# EAGLE design Relay_Board (EAGLE 7.1.0)
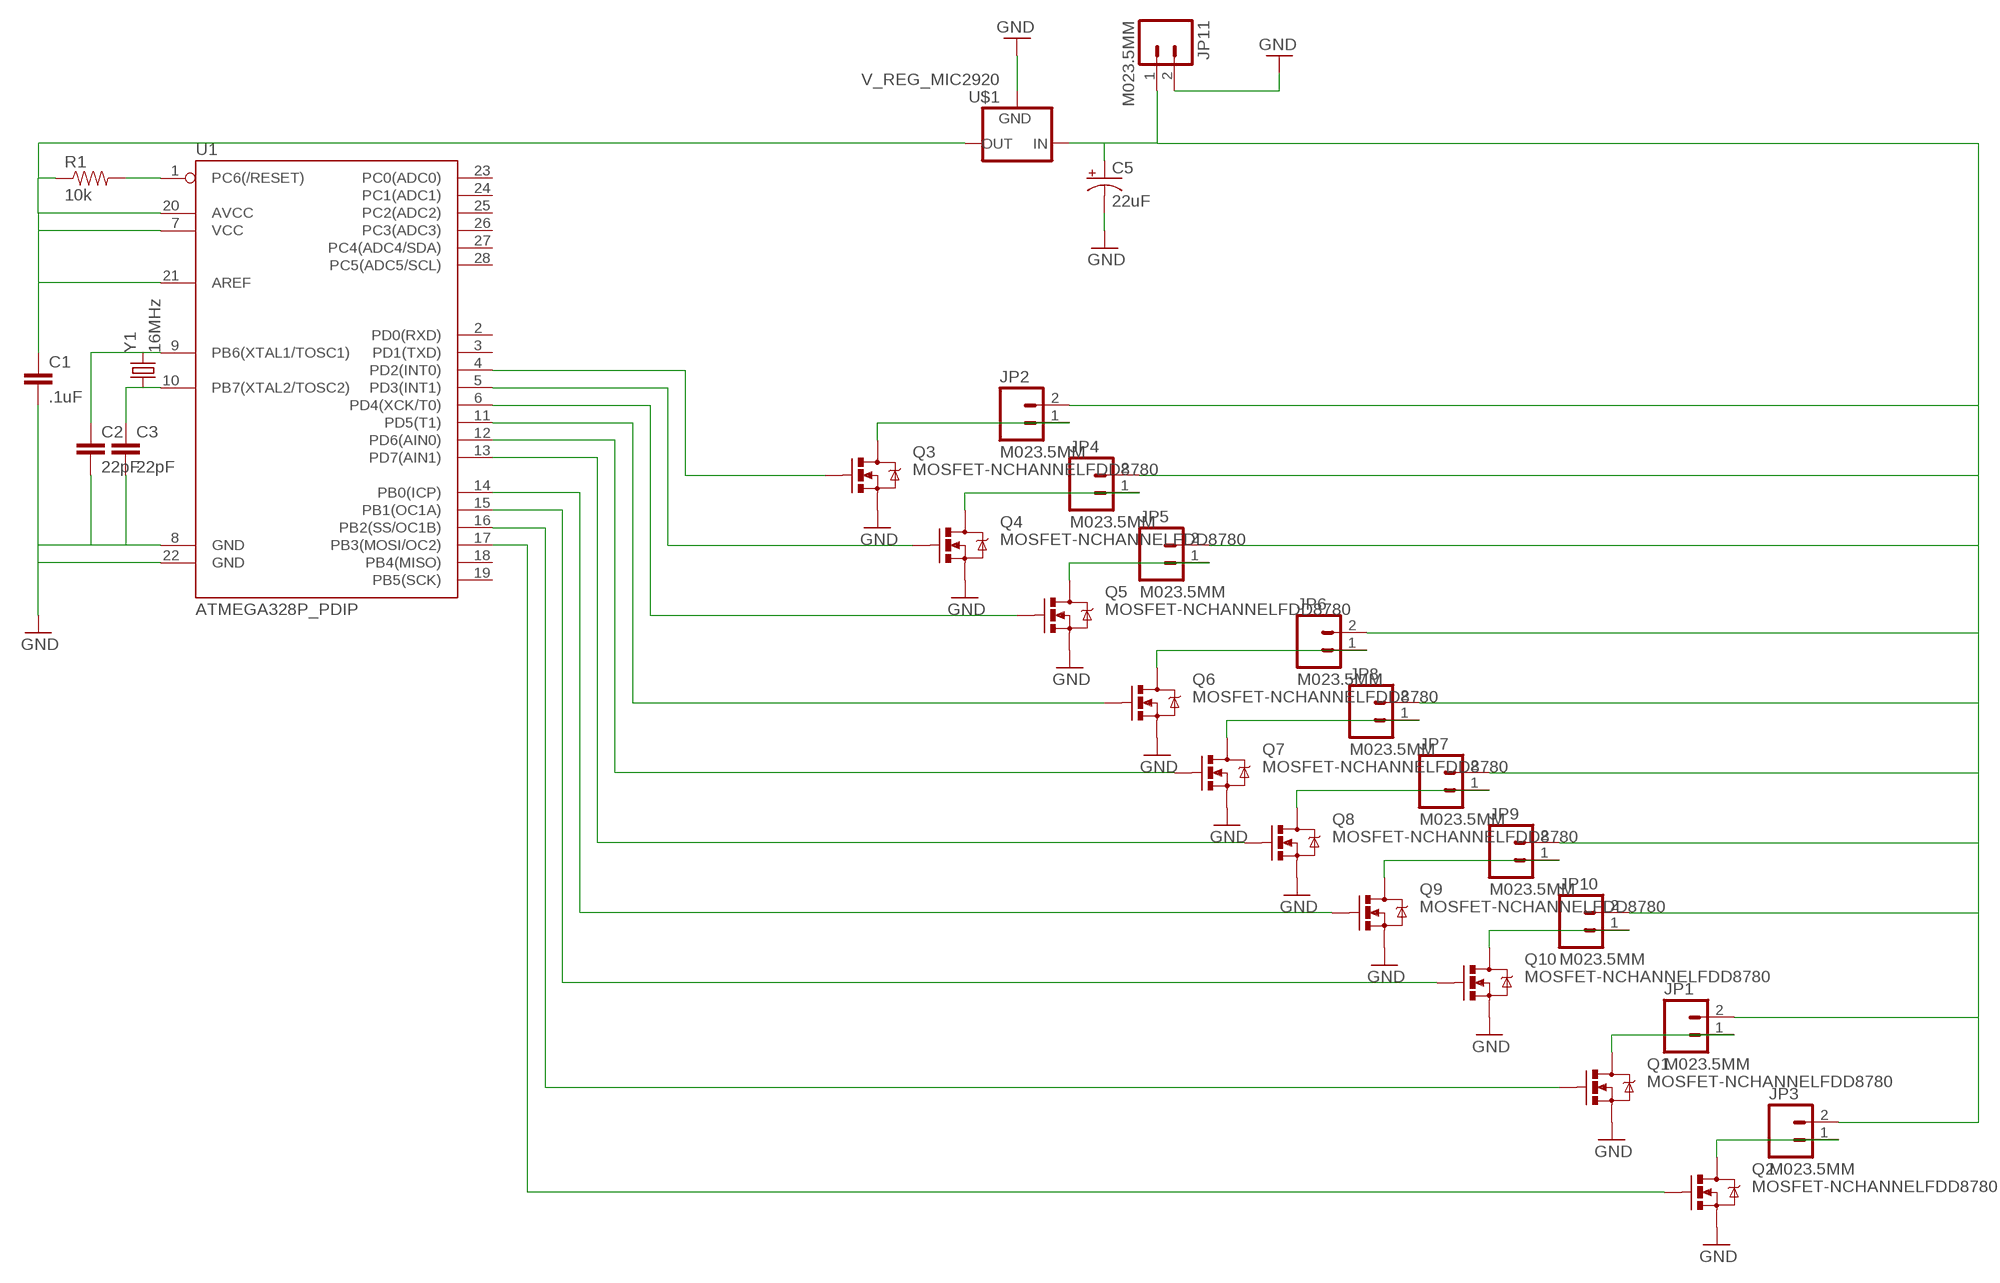
[diagram p0: schematic, sheet 1]

## Parts
C1  .1uF  CAP1206  [1206]
C2  22pF  CAP1206  [1206]
C3  22pF  CAP1206  [1206]
C5  22uF  CAP_POLC  [PANASONIC_C]
JP1  M023.5MM  [SCREWTERMINAL-3.5MM-2]
JP2  M023.5MM  [SCREWTERMINAL-3.5MM-2]
JP3  M023.5MM  [SCREWTERMINAL-3.5MM-2]
JP4  M023.5MM  [SCREWTERMINAL-3.5MM-2]
JP5  M023.5MM  [SCREWTERMINAL-3.5MM-2]
JP6  M023.5MM  [SCREWTERMINAL-3.5MM-2]
JP7  M023.5MM  [SCREWTERMINAL-3.5MM-2]
JP8  M023.5MM  [SCREWTERMINAL-3.5MM-2]
JP9  M023.5MM  [SCREWTERMINAL-3.5MM-2]
JP10  M023.5MM  [SCREWTERMINAL-3.5MM-2]
JP11  M023.5MM  [SCREWTERMINAL-3.5MM-2]
Q1  MOSFET-NCHANNELFDD8780  [DPAK]
Q2  MOSFET-NCHANNELFDD8780  [DPAK]
Q3  MOSFET-NCHANNELFDD8780  [DPAK]
Q4  MOSFET-NCHANNELFDD8780  [DPAK]
Q5  MOSFET-NCHANNELFDD8780  [DPAK]
Q6  MOSFET-NCHANNELFDD8780  [DPAK]
Q7  MOSFET-NCHANNELFDD8780  [DPAK]
Q8  MOSFET-NCHANNELFDD8780  [DPAK]
Q9  MOSFET-NCHANNELFDD8780  [DPAK]
Q10  MOSFET-NCHANNELFDD8780  [DPAK]
R1  10k  RESISTOR1206  [1206]
U1  ATMEGA328P_PDIP  [DIL28-3]
U$1  V_REG_MIC2920  [SOT223]
Y1  16MHz  CRYSTAL5X3  [CRYSTAL-SMD-5X3]

## Nets
12V: C5.+ JP1.2 JP2.2 JP3.2 JP4.2 JP5.2 JP6.2 JP7.2 JP8.2 JP9.2 JP10.2 JP11.1 U$1.1(IN)
GND: C1.2 C2.2 C3.2 C5.- JP11.2 Q1.3(S) Q2.3(S) Q3.3(S) Q4.3(S) Q5.3(S) Q6.3(S) Q7.3(S) Q8.3(S) Q9.3(S) Q10.3(S) U1.8(GND) U1.22(GND) U$1.2(GND)
N$1: Q1.1(G) U1.16(PB2(SS/OC1B))
N$2: R1.2 U1.1(PC6(/RESET))
N$3: C2.1 U1.9(PB6(XTAL1/TOSC1)) Y1.3
N$4: C3.1 U1.10(PB7(XTAL2/TOSC2)) Y1.1
N$5: Q2.1(G) U1.17(PB3(MOSI/OC2))
N$6: JP1.1 Q1.4(D)
N$7: JP3.1 Q2.4(D)
N$8: JP2.1 Q3.4(D)
N$9: Q3.1(G) U1.4(PD2(INT0))
N$10: Q4.1(G) U1.5(PD3(INT1))
N$11: JP4.1 Q4.4(D)
N$12: JP5.1 Q5.4(D)
N$13: Q5.1(G) U1.6(PD4(XCK/T0))
N$14: JP6.1 Q6.4(D)
N$15: Q7.1(G) U1.12(PD6(AIN0))
N$16: JP8.1 Q7.4(D)
N$17: JP7.1 Q8.4(D)
N$18: Q8.1(G) U1.13(PD7(AIN1))
N$19: Q9.1(G) U1.14(PB0(ICP))
N$20: JP9.1 Q9.4(D)
N$21: JP10.1 Q10.4(D)
N$22: Q10.1(G) U1.15(PB1(OC1A))
N$23: Q6.1(G) U1.11(PD5(T1))
N$25: C1.1 R1.1 U1.7(VCC) U1.20(AVCC) U1.21(AREF) U$1.3(OUT)
Unconnected: U1.2(PD0(RXD)) U1.3(PD1(TXD)) U1.18(PB4(MISO)) U1.19(PB5(SCK)) U1.23(PC0(ADC0)) U1.24(PC1(ADC1)) U1.25(PC2(ADC2)) U1.26(PC3(ADC3)) U1.27(PC4(ADC4/SDA)) U1.28(PC5(ADC5/SCL))

## Library data of the parts
C1-C3 = SparkFun-Passives:CAP: Capacitor Standard 0603 ceramic capacitor, and 0.1" leaded capacitor.
C5 = SparkFun-Passives:CAP_POL: Capacitor Polarized These are standard SMD and PTH capacitors. Normally 10uF, 47uF, and 100uF in electrolytic and tantalum varieties. Always verify the external diameter of the through hole cap, it varies with capacity, voltage, and manufacturer. The EIA devices should be standard.
JP1-JP11 = SparkFun-Connectors:M02: Standard 2-pin 0.1" header. Use with - straight break away headers ( PRT-00116) - right angle break away headers (PRT-00553) - swiss pins (PRT-00743) - machine pins (PRT-00117) - female headers (PRT-00115) Molex polarized connector foot print use with: PRT-08233 with associated crimp pins and housings. 2.54_SCREWTERM for use with PRT-10571. 3.5mm Screw Terminal footprints for PRT-08084 5mm Screw Terminal footprints for use with PRT-08433
Q1-Q10 = SparkFun-DiscreteSemi:MOSFET-NCHANNEL: Common NMOSFET Parts MFG P/N Store ID Prod ID FDD8780 TRANS-09984 SI7820DN TRANS-11055 FDS6630A IC-08089 2N7002PW TRANS-11151 FQP30N06L COM-10213 TRANS-10060 BSS123LT1G TRANS-08345 BSS138 TRANS-00830 BS170 2N7000; PROD_ID: TRANS-09984
R1 = SparkFun-Passives:RESISTOR: Resistor Basic schematic elements and footprints for 0603, 1206, and PTH resistors.
U1 = SparkFun-DigitalIC:ATMEGA328P_PDIP: uC used in the Arduino 32kb flash, 1k EEPROM, 2k SRAM This is the through-hole version of this chip.
U$1 = SparkFun-PowerIC:V_REG_MIC2920: MIC2920A (http://www.micrel.com/_PDF/mic2920.pdf) - 400mA output LDO Regulator
Y1 = SparkFun-FreqCtrl:CRYSTAL: Various standard crystals. Proven footprints. Spark Fun Electronics SKU : COM-00534

## Board
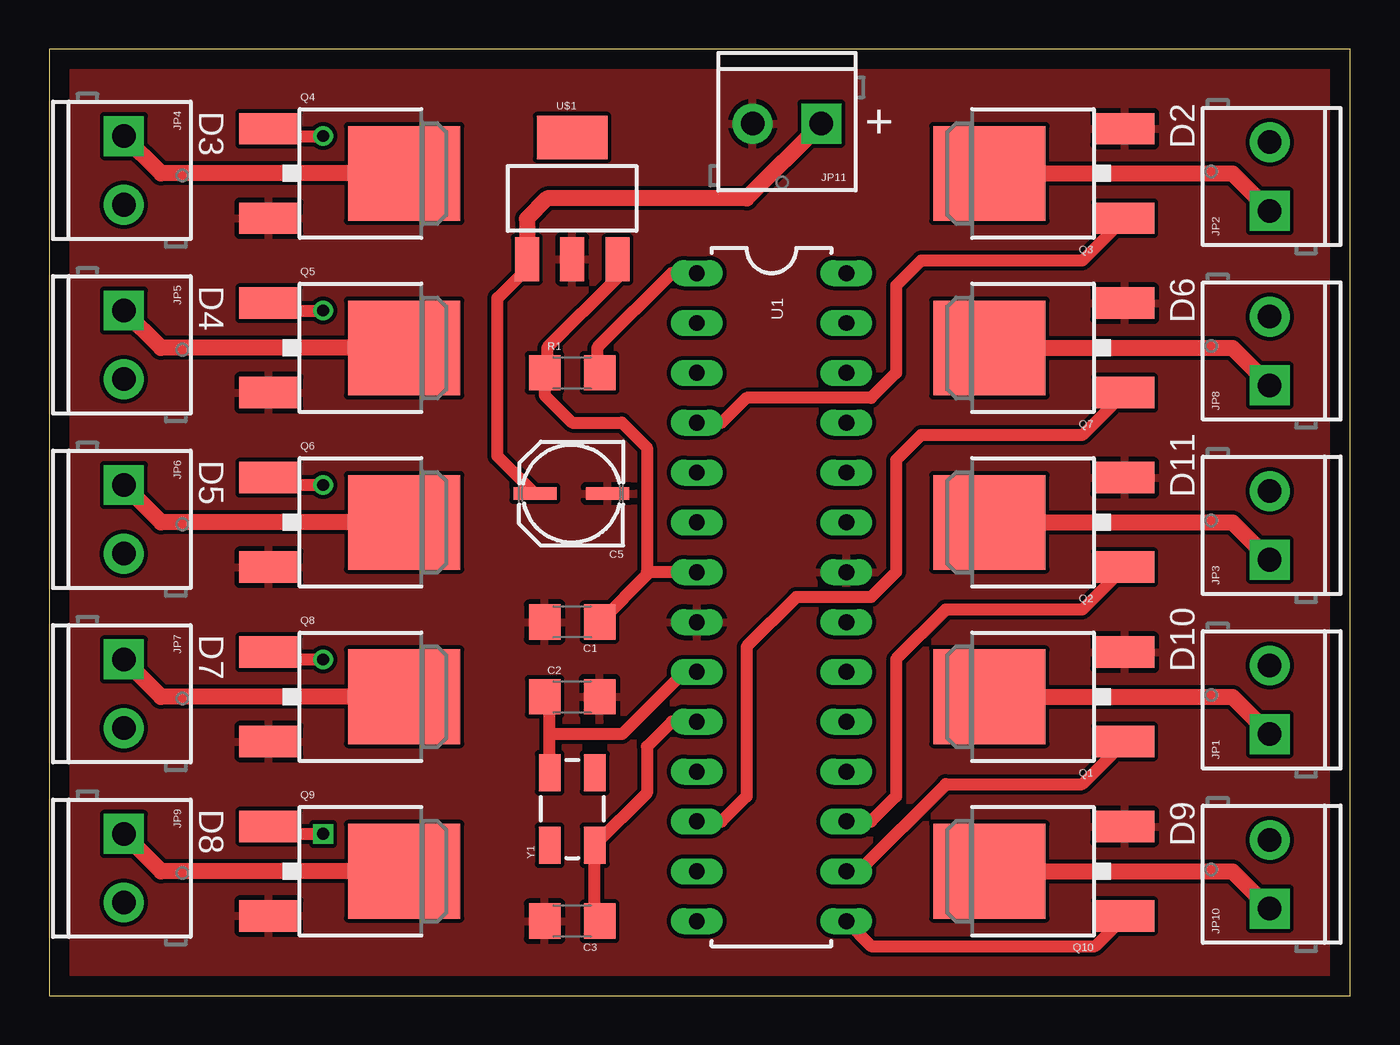
[diagram p1: board, top side]
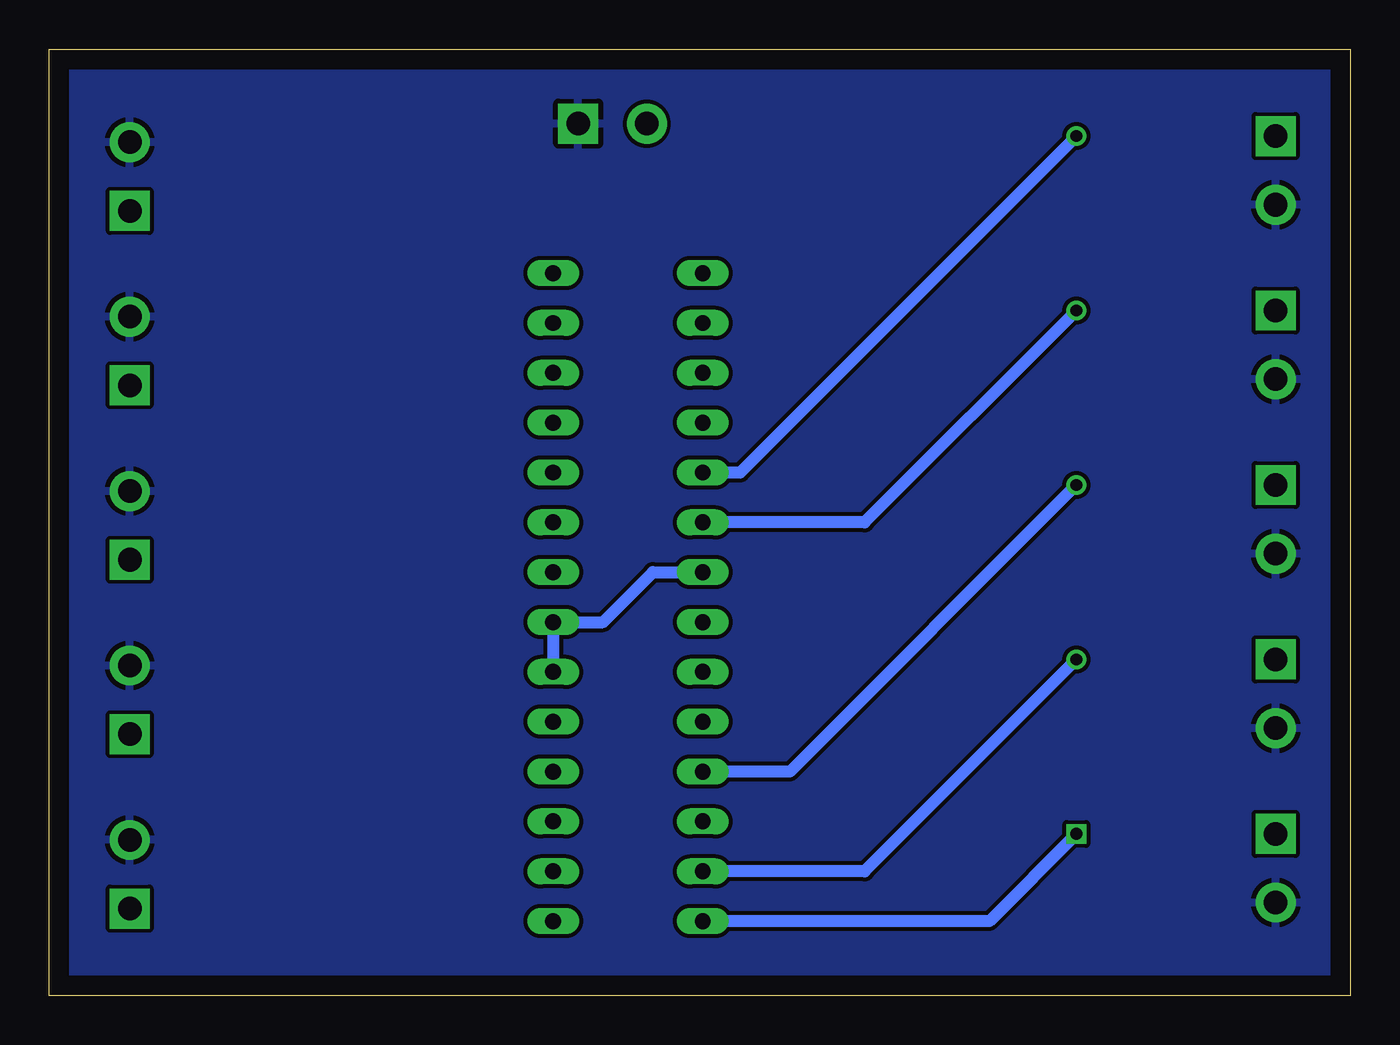
[diagram p2: board, bottom side, seen from below]

Size 66.34 x 48.25 mm. Coordinates in mm from the lower left corner, seen from the top.
Outline: 0,0 66.34,0 66.34,48.25 0,48.25 0,0
Copper layers (1*16): Top 0.035mm / dielectric 1.5mm / Bottom 0.035mm
Design rules "default": minimum track width 10mil, minimum drill 24mil, track to track 8mil, track to pad 8mil, pad to pad 8mil, via to via 8mil, smd to smd 8mil, copper to edge 40mil, drill to drill 8mil, minimum pad ring 10mil, minimum via ring 8mil, stop-mask expansion 4mil, vias tented up to drill 0mil, thermal gap 10mil

### Footprints (pad centres in the part's own frame; a part is rotated, then mirrored left to right if it is on the bottom)
1206 = smd 1.6 x 1.8: 1 -1.4,0; 2 1.4,0
PANASONIC_C = smd 2.2 x 0.65: + 1.9,-0.2; - -1.8,-0.2
SCREWTERMINAL-3.5MM-2 = drill 1.2 pad 2.032 square: 1 0,0 | drill 1.2 pad 2.032: 2 3.5,0
DPAK = smd 1.6 x 3: 1 -2.28,-5.31; 3 2.28,-5.31 | smd 4.826 x 5.715: 4 0,1.588
DIL28-3 = drill 0.813 long: 1 -16.51,-3.81; 2 -13.97,-3.81; 3 -11.43,-3.81; 4 -8.89,-3.81; 5 -6.35,-3.81; 6 -3.81,-3.81; 7 -1.27,-3.81; 8 1.27,-3.81; 9 3.81,-3.81; 10 6.35,-3.81; 11 8.89,-3.81; 12 11.43,-3.81; 13 13.97,-3.81; 14 16.51,-3.81; 15 16.51,3.81; 16 13.97,3.81; 17 11.43,3.81; 18 8.89,3.81; 19 6.35,3.81; 20 3.81,3.81; 21 1.27,3.81; 22 -1.27,3.81; 23 -3.81,3.81; 24 -6.35,3.81; 25 -8.89,3.81; 26 -11.43,3.81; 27 -13.97,3.81; 28 -16.51,3.81
SOT223 = smd 1.219 x 2.235: 1 -2.311,-3.099; 2 0,-3.099; 3 2.311,-3.099 | smd 3.6 x 2.2: 4 0,3.099
CRYSTAL-SMD-5X3 = smd 1.9 x 1.1: 1 -1.85,-1.15; 2 1.85,-1.15; 3 1.85,1.15; 4 -1.85,1.15

### Placement (x,y rotation side)
C1  26.67,19.05 180 top
C2  26.67,15.24 0 top
C3  26.67,3.81 180 top
C5  26.67,25.4 180 top
JP1  62.23,13.33 90 top
JP2  62.23,40 90 top
JP3  62.23,22.22 90 top
JP4  3.81,43.81 270 top
JP5  3.81,34.92 270 top
JP6  3.81,26.04 270 top
JP7  3.81,17.14 270 top
JP8  62.23,31.11 90 top
JP9  3.81,8.25 270 top
JP10  62.23,4.45 90 top
JP11  39.37,44.45 180 top
Q1  49.53,15.24 90 top
Q2  49.53,24.13 90 top
Q3  49.53,41.91 90 top
Q4  16.51,41.91 270 top
Q5  16.51,33.02 270 top
Q6  16.51,24.13 270 top
Q7  49.53,33.02 90 top
Q8  16.51,15.24 270 top
Q9  16.51,6.35 270 top
Q10  49.53,6.35 90 top
R1  26.67,31.75 0 top
U1  36.83,20.32 270 top
U$1  26.67,40.64 0 top
Y1  26.67,9.52 90 top

### Tracks (layer width: path | path; a pad name or v marks a point on that pad's centre or on a via)
12V
  Top 0.61: C5.+ 22.86,27.51 22.86,35.56 24.36,37.06 U$1.1
  Top 0.813: JP11.1 35.56,40.64 25.4,40.64 24.36,39.6 U$1.1
  pour Bottom: -27.94,64.77 81.28,64.77 81.28,-24.13 -27.94,-24.13
GND
  pour Top: -31.75,68.58 -31.75,-29.21 88.9,-29.21 88.9,68.58
N$1
  Top 0.61: U1.16 41.28,6.35 45.72,10.79 52.68,10.79 Q1.1
N$2
  Top 0.61: U1.1 31.75,36.83 27.94,33.02 27.94,31.88 R1.2
N$3
  Top 0.61: Y1.3 25.52,13.33 | 25.52,13.33 25.52,14.99 C2.1 | U1.9 32.39,16.51 29.21,13.33 25.52,13.33
N$4
  Top 0.61: C3.1 27.82,4.06 Y1.1 30.48,10.34 30.48,12.7 31.75,13.97 U1.10
N$5
  Top 0.61: Q2.1 52.68,19.68 45.72,19.68 43.18,17.14 43.18,10.16 41.91,8.89 U1.17
N$6
  Top 0.813: Q1.4 60.33,15.24 JP1.1
N$7
  Top 0.813: Q2.4 60.33,24.13 JP3.1
N$8
  Top 0.813: Q3.4 60.33,41.91 JP2.1
N$9
  Top 0.61: Q3.1 52.68,37.47 44.45,37.47 43.18,36.19 43.18,31.75 41.91,30.48 35.56,30.48 34.29,29.21 U1.4
N$10  (via drill 0.6)
  Top 0.61: Q4.1 11.57,43.81 v13.97,43.81
  Bottom 0.61: v13.97,43.81 31.11,26.67 U1.5
N$11
  Top 0.813: Q4.4 5.71,41.91 JP4.1
N$12
  Top 0.813: Q5.4 5.71,33.02 JP5.1
N$13  (via drill 0.6)
  Top 0.61: Q5.1 11.57,34.92 v13.97,34.92
  Bottom 0.61: v13.97,34.92 24.77,24.13 U1.6
N$14
  Top 0.813: Q6.4 5.71,24.13 JP6.1
N$15
  Top 0.61: Q7.1 52.68,28.57 44.45,28.57 43.18,27.3 43.18,21.59 41.91,20.32 38.1,20.32 35.56,17.78 35.56,10.16 34.29,8.89 U1.12
N$16
  Top 0.813: Q7.4 60.33,33.02 JP8.1
N$17
  Top 0.813: Q8.4 5.71,15.24 JP7.1
N$18  (via drill 0.6)
  Top 0.61: Q8.1 11.57,17.14 v13.97,17.14
  Bottom 0.61: v13.97,17.14 24.77,6.35 U1.13
N$19  (via drill 0.6)
  Top 0.61: Q9.1 11.57,8.25 v13.97,8.25
  Bottom 0.61: v13.97,8.25 18.42,3.81 U1.14
N$20
  Top 0.813: Q9.4 5.71,6.35 JP9.1
N$21
  Top 0.813: Q10.4 60.33,6.35 JP10.1
N$22
  Top 0.61: U1.15 41.91,2.54 53.34,2.54 54.84,4.04 Q10.1
N$23  (via drill 0.6)
  Top 0.61: Q6.1 11.57,26.04 v13.97,26.04
  Bottom 0.61: v13.97,26.04 28.57,11.43 U1.11
N$25
  Top 0.61: U1.7 30.61,21.59 30.54,21.53 | 30.54,21.53 C1.1 | U$1.3 28.98,36.6 25.4,33.02 25.4,31.88 R1.1 25.27,30.61 26.67,29.21 29.21,29.21 30.48,27.94 30.48,21.59 30.54,21.53
  Bottom 0.61: U1.7 35.56,21.59 38.1,19.05 U1.21 U1.20

### Text on the board
tPlace: D3 | + | D2 | D4 | D6 | D5 | D11 | D7 | D10 | D8 | D9